# EAGLE design Drapled-PWM (EAGLE 5.11)
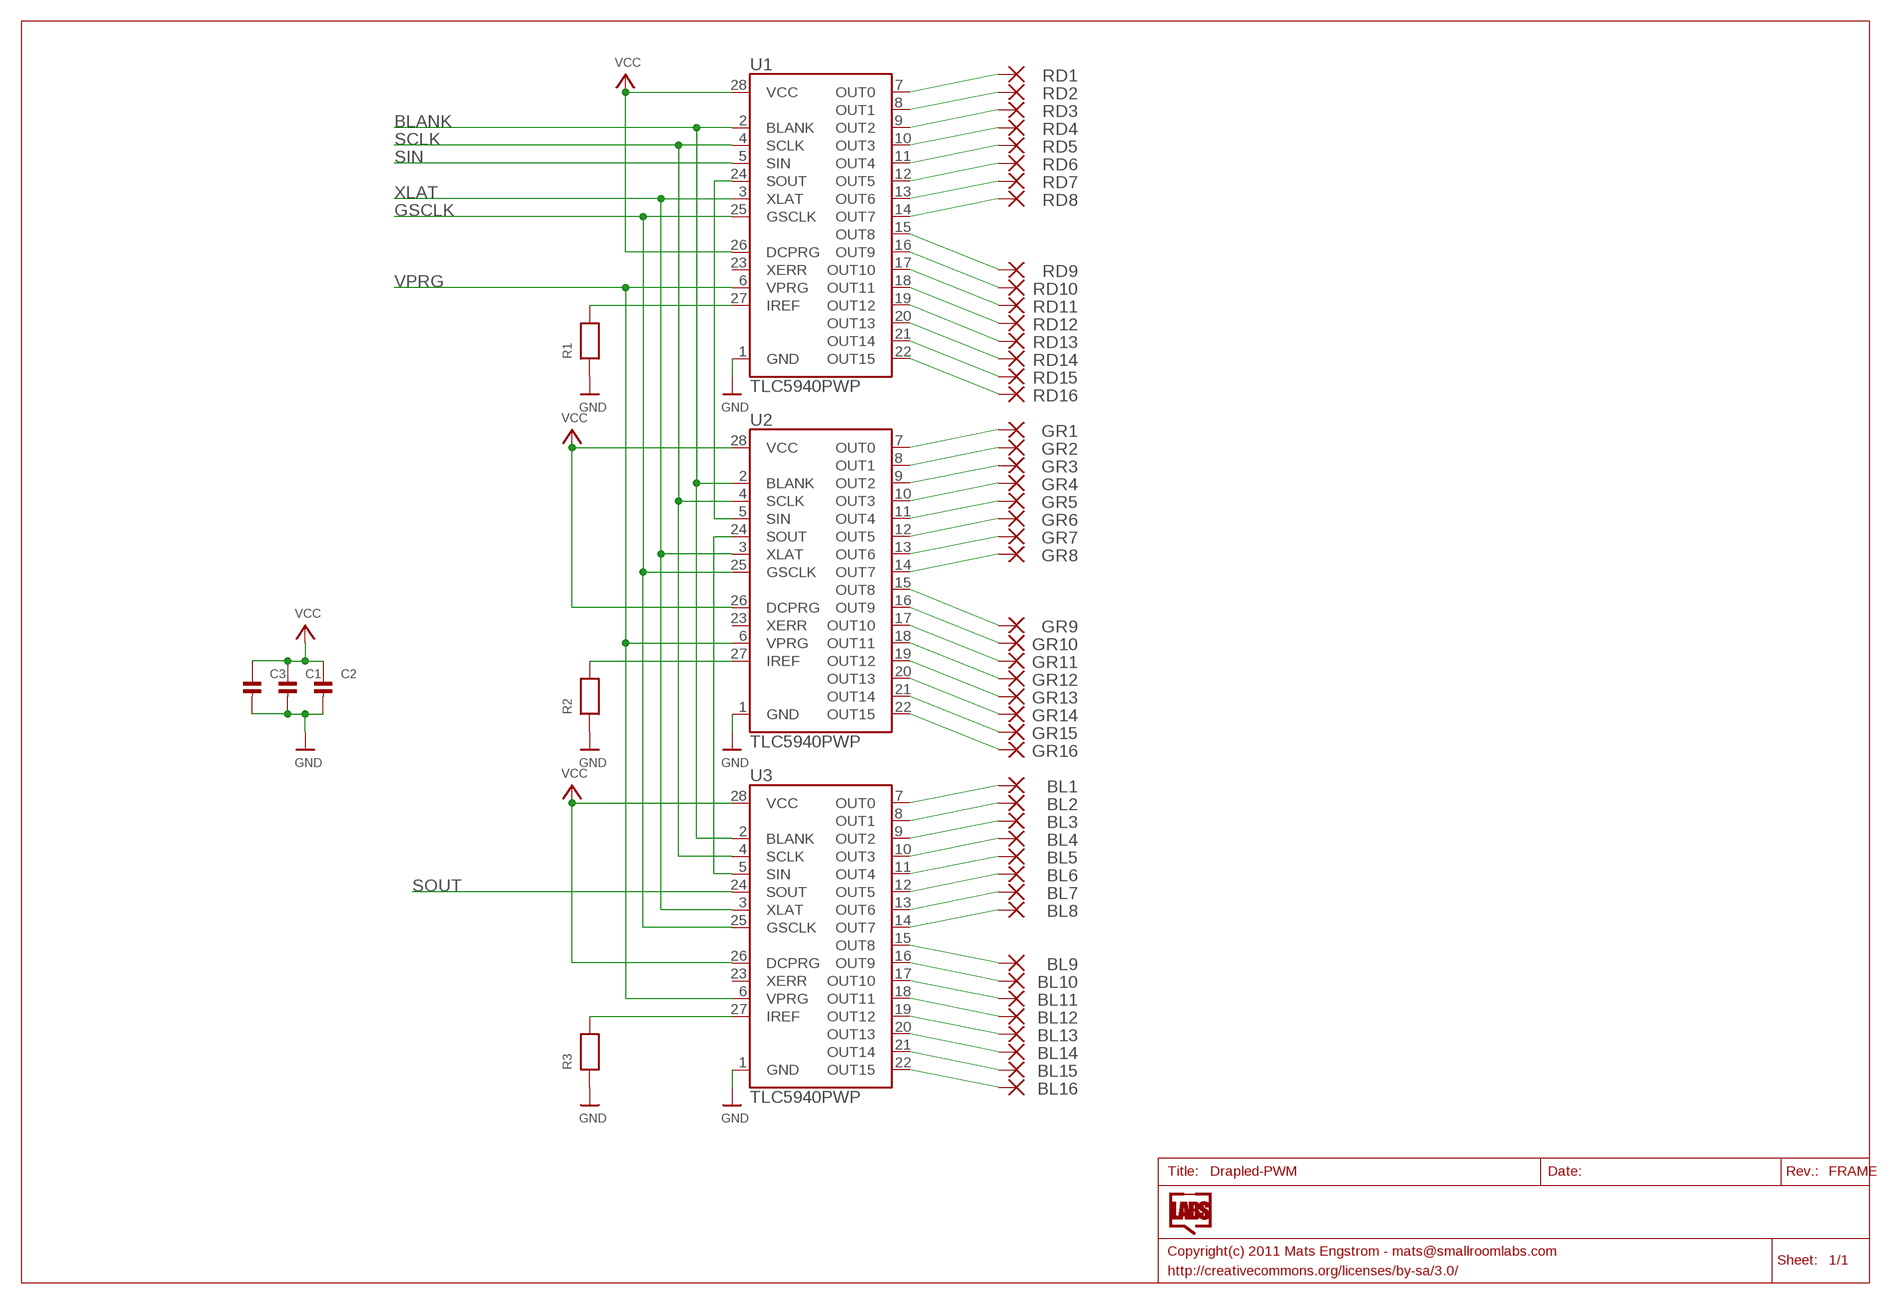
[diagram p0: schematic, sheet 1]

## Parts
BL1  1,6/0,9  [1,6/0,9]
BL2  1,6/0,9  [1,6/0,9]
BL3  1,6/0,9  [1,6/0,9]
BL4  1,6/0,9  [1,6/0,9]
BL5  1,6/0,9  [1,6/0,9]
BL6  1,6/0,9  [1,6/0,9]
BL7  1,6/0,9  [1,6/0,9]
BL8  1,6/0,9  [1,6/0,9]
BL9  1,6/0,9  [1,6/0,9]
BL10  1,6/0,9  [1,6/0,9]
BL11  1,6/0,9  [1,6/0,9]
BL12  1,6/0,9  [1,6/0,9]
BL13  1,6/0,9  [1,6/0,9]
BL14  1,6/0,9  [1,6/0,9]
BL15  1,6/0,9  [1,6/0,9]
BL16  1,6/0,9  [1,6/0,9]
C1  CAP_CERAMIC0805  [0805]
C2  CAP_CERAMIC0805  [0805]
C3  CAP_CERAMIC0805  [0805]
GR1  1,6/0,9  [1,6/0,9]
GR2  1,6/0,9  [1,6/0,9]
GR3  1,6/0,9  [1,6/0,9]
GR4  1,6/0,9  [1,6/0,9]
GR5  1,6/0,9  [1,6/0,9]
GR6  1,6/0,9  [1,6/0,9]
GR7  1,6/0,9  [1,6/0,9]
GR8  1,6/0,9  [1,6/0,9]
GR9  1,6/0,9  [1,6/0,9]
GR10  1,6/0,9  [1,6/0,9]
GR11  1,6/0,9  [1,6/0,9]
GR12  1,6/0,9  [1,6/0,9]
GR13  1,6/0,9  [1,6/0,9]
GR14  1,6/0,9  [1,6/0,9]
GR15  1,6/0,9  [1,6/0,9]
GR16  1,6/0,9  [1,6/0,9]
R1  RESISTOR0805  [0805]
R2  RESISTOR0805  [0805]
R3  RESISTOR0805  [0805]
RD1  1,6/0,9  [1,6/0,9]
RD2  1,6/0,9  [1,6/0,9]
RD3  1,6/0,9  [1,6/0,9]
RD4  1,6/0,9  [1,6/0,9]
RD5  1,6/0,9  [1,6/0,9]
RD6  1,6/0,9  [1,6/0,9]
RD7  1,6/0,9  [1,6/0,9]
RD8  1,6/0,9  [1,6/0,9]
RD9  1,6/0,9  [1,6/0,9]
RD10  1,6/0,9  [1,6/0,9]
RD11  1,6/0,9  [1,6/0,9]
RD12  1,6/0,9  [1,6/0,9]
RD13  1,6/0,9  [1,6/0,9]
RD14  1,6/0,9  [1,6/0,9]
RD15  1,6/0,9  [1,6/0,9]
RD16  1,6/0,9  [1,6/0,9]
U1  TLC5940PWP  [TSSOP28-GROUNDPAD]
U2  TLC5940PWP  [TSSOP28-GROUNDPAD]
U3  TLC5940PWP  [TSSOP28-GROUNDPAD]

## Nets
BLANK: U1.2(BLANK) U2.2(BLANK) U3.2(BLANK)
GND [gnd]: C1.2 C2.2 C3.2 R1.1 R2.1 R3.1 U1.1(GND) U2.1(GND) U3.1(GND)
GSCLK: U1.25(GSCLK) U2.25(GSCLK) U3.25(GSCLK)
LED1B: BL1.1(P) U3.7(OUT0)
LED1G: GR1.1(P) U2.7(OUT0)
LED1R: RD1.1(P) U1.7(OUT0)
LED2B: BL2.1(P) U3.8(OUT1)
LED2G: GR2.1(P) U2.8(OUT1)
LED2R: RD2.1(P) U1.8(OUT1)
LED3B: BL3.1(P) U3.9(OUT2)
LED3G: GR3.1(P) U2.9(OUT2)
LED3R: RD3.1(P) U1.9(OUT2)
LED4B: BL4.1(P) U3.10(OUT3)
LED4G: GR4.1(P) U2.10(OUT3)
LED4R: RD4.1(P) U1.10(OUT3)
LED5B: BL5.1(P) U3.11(OUT4)
LED5G: GR5.1(P) U2.11(OUT4)
LED5R: RD5.1(P) U1.11(OUT4)
LED6B: BL6.1(P) U3.12(OUT5)
LED6G: GR6.1(P) U2.12(OUT5)
LED6R: RD6.1(P) U1.12(OUT5)
LED7B: BL7.1(P) U3.13(OUT6)
LED7G: GR7.1(P) U2.13(OUT6)
LED7R: RD7.1(P) U1.13(OUT6)
LED8B: BL8.1(P) U3.14(OUT7)
LED8G: GR8.1(P) U2.14(OUT7)
LED8R: RD8.1(P) U1.14(OUT7)
LED9B: BL9.1(P) U3.15(OUT8)
LED9G: GR9.1(P) U2.15(OUT8)
LED9R: RD9.1(P) U1.15(OUT8)
LED10B: BL10.1(P) U3.16(OUT9)
LED10G: GR10.1(P) U2.16(OUT9)
LED10R: RD10.1(P) U1.16(OUT9)
LED11B: BL11.1(P) U3.17(OUT10)
LED11G: GR11.1(P) U2.17(OUT10)
LED11R: RD11.1(P) U1.17(OUT10)
LED12B: BL12.1(P) U3.18(OUT11)
LED12G: GR12.1(P) U2.18(OUT11)
LED12R: RD12.1(P) U1.18(OUT11)
LED13B: BL13.1(P) U3.19(OUT12)
LED13G: GR13.1(P) U2.19(OUT12)
LED13R: RD13.1(P) U1.19(OUT12)
LED14B: BL14.1(P) U3.20(OUT13)
LED14G: GR14.1(P) U2.20(OUT13)
LED14R: RD14.1(P) U1.20(OUT13)
LED15B: BL15.1(P) U3.21(OUT14)
LED15G: GR15.1(P) U2.21(OUT14)
LED15R: RD15.1(P) U1.21(OUT14)
LED16B: BL16.1(P) U3.22(OUT15)
LED16G: GR16.1(P) U2.22(OUT15)
LED16R: RD16.1(P) U1.22(OUT15)
N$34: U1.24(SOUT) U2.5(SIN)
N$39: R1.2 U1.27(IREF)
N$40: R2.2 U2.27(IREF)
N$59: R3.2 U3.27(IREF)
N$61: U2.24(SOUT) U3.5(SIN)
SCLK: U1.4(SCLK) U2.4(SCLK) U3.4(SCLK)
SIN: U1.5(SIN)
SOUT: U3.24(SOUT)
VCC: C1.1 C2.1 C3.1 U1.26(DCPRG) U1.28(VCC) U2.26(DCPRG) U2.28(VCC) U3.26(DCPRG) U3.28(VCC)
VPRG: U1.6(VPRG) U2.6(VPRG) U3.6(VPRG)
XLAT: U1.3(XLAT) U2.3(XLAT) U3.3(XLAT)
Unconnected: U1.23(XERR) U2.23(XERR) U3.23(XERR)

## Library data of the parts
BL1-BL16 GR1-GR16 RD1-RD16 = wirepad:1,6/0,9: THROUGH-HOLE PAD
C1-C3 = microbuilder:CAP_CERAMIC: Ceramic Capacitors 0402 - 0402 Surface Mount Capacitors 0.1uF 10V 10% [Digikey: 490-1318-2-ND] 0603 - 0603 Surface Mount Capacitors 16 pF 50V 5% [Digikey: 445-5051-2-ND] 22 pF 50V [Digikey: PCC220ACVTR-ND] 33 pF 50V 5% [Digikey: 490-1415-1-ND] 56pF 50V 5% [Digikey: 490-1421-1-ND] 220pF 50V 5% [Digikey: 445-1285-1-ND] 680 pF 50V 2200 pF 50V 5% C0G [Digikey: 445-1297-1-ND] 5600 pF 100V 5% X7R [Digikey: 478-3711-1-ND] 0.1 µF 25V 10% [Digikey: PCC2277TR-ND] 0.22 µF 16V 10% X7R [Digikey: 445-1318-1-ND] 1.0 µF 25V 10% [Digikey: 445-5146-2-ND] 0603 - RF Specific 3pF 250V +/-0.1pF RF [Digikey: 712-1347-1-ND] 18 pF 250V 5% [Digikey: 478-3505-1-ND or 712-1322-1-ND] 56 pF 250V 5% C0G RF [Digikey: 490-4867-1-ND] 68 pF 250V RF [Digikey: 490-4868-1-ND] 0805 - 0805 Surface Mount Capacitors 220 pF 250V 2% RF Ceramic Capacitor [Digikey: 712-1398-1-ND] 1000 pF 50V 2% NP0 Ceramic Capacitor [Digikey: 478-3760-1-ND] 0.1 µF 25V 10% Ceramic Capacitor [Digikey: PCC1828TR-ND] 1.0 µF 16V 10% Ceramic Capacitor[Digikey: 490-1691-2-ND] 10.0 µF 10V 10% Ceramic Capacitor[Digikey: 709-1228-1-ND] 1206 - 1206 Surface Mount Capacitors
R1-R3 = microbuilder:RESISTOR: Resistors 0402 - 0402 Surface Mount Package 10.0K 1% 1/16W [Digikey: 311-10.0KLRTR-ND] 0603 - 0603 Surface Mount Package 0 Ohm 1/10 Watt 1% Resistor 15 Ohm 1/10 Watt 1% Resistor 33 Ohm 1/10 Watt 1% Resistor 49.9 Ohm 1/10 Watt 1% Resistor 100 Ohm 1/10 Watt 1% Resistor 150 Ohm 1/10 Watt 1% Resistor 240 Ohm 1/10 Watt 1% Resistor 390 Ohm 1/10 Watt 1% Resistor 560 Ohm 1/10 Watt 1% Resistor 750 Ohm 1/10 Watt 1% Resistor 1.0K Ohm 1/10 Watt 1% Resistor 1.5K Ohm 1/10 Watt 1% Resistor 2.0K Ohm 1/10 Watt 1% Resistor 4.7K Ohm 1/10 Watt 1% Resistor 10.0K Ohm 1/10 Watt 1% Resistor 20.0K Ohm 1/10 Watt 1% Resistor 33.0K Ohm 1/10 Watt 1% Resistor 100.0K Ohm 1/10 Watt 1% Resistor 0805 - 0805 Surface Mount Package 0 Ohm 1/8 Watt 1% Resistor 33 Ohm 1/8 Watt 1% Resistor 100 Ohm 1/8 Watt 1% Resistor 150 Ohm 1/8 Watt 1% Resistor 200 Ohm 1/8 Watt 1% Resistor 240 Ohm 1/8 Watt 1% Resistor 330 Ohm 1/8 Watt 1% Resistor 390 Ohm 1/8 Watt 1% Resistor 470 Ohm 1/8 Watt 1% Resistor 1.0K Ohm 1/8 Watt 1% Resistor 1.5K Ohm 1/8 Watt 1% Resistor 2.0K Ohm 1/8 Watt 1% Resistor 4.7K Ohm 1/8 Watt 1% Resistor 5.1K Ohm 1/8 Watt 1% Resistor 5.6K Ohm 1/8 Watt 1% Resistor 10.0K Ohm 1/8 Watt 1% Resistor 22.0K Ohm 1/8 Watt 1% Resistor 33.0K Ohm 1/8 Watt 1% Resistor 100K Ohm 1/8 Watt 1% Resistor 1206 - 1206 Surface Mount Package
U1-U3 = SparkFun:TLC5940: TI TLC5940 16-channel LED Driver with Dot Correction and Grayscale PWM Control The TLC5940 is a 16-channel, constant-current sink LED driver. Each channel has an individually adjustable 4096-step grayscale PWM brightness control and a 64-step, constant-current sink (dot correction). The dot correction adjusts the brightness variations between LED channels and other LED drivers. The dot correction data is stored in an integrated EEPROM. Both grayscale control and dot correction are accessible via a serial interface. A single external resistor sets the maximum current value of all 16 channels. Packages: 28-pin HTSSOP 32-pin 5x5mm QFN 28-pin DIP

## Net classes
0 default: width 0.152 mm, clearance 0.152 mm
1 gnd: width 0.254 mm, clearance 0.178 mm

## Board
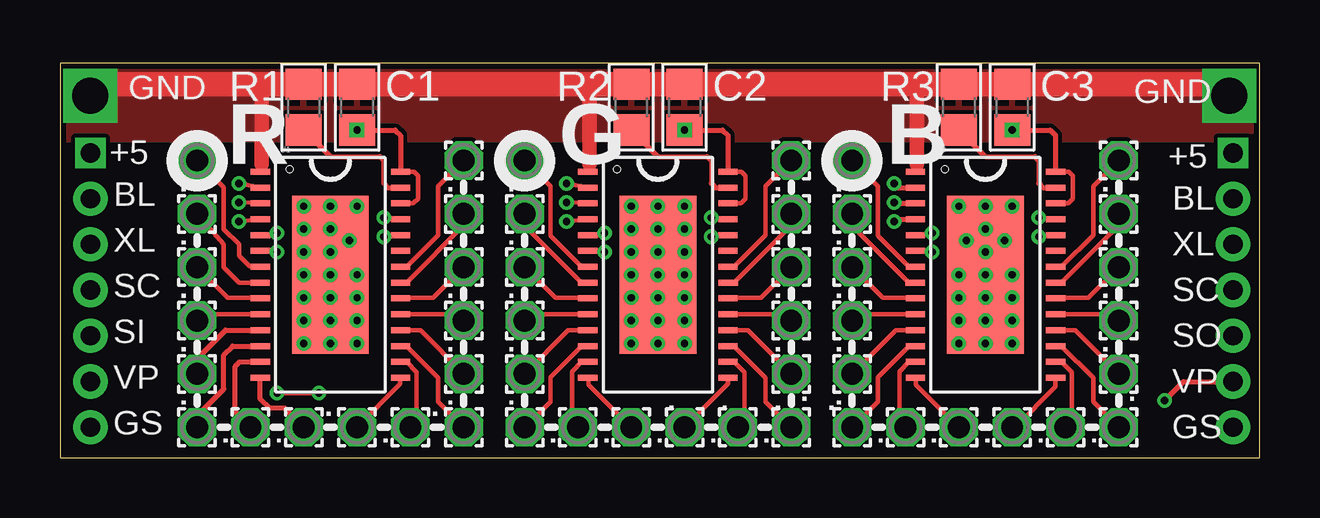
[diagram p1: board, top side]
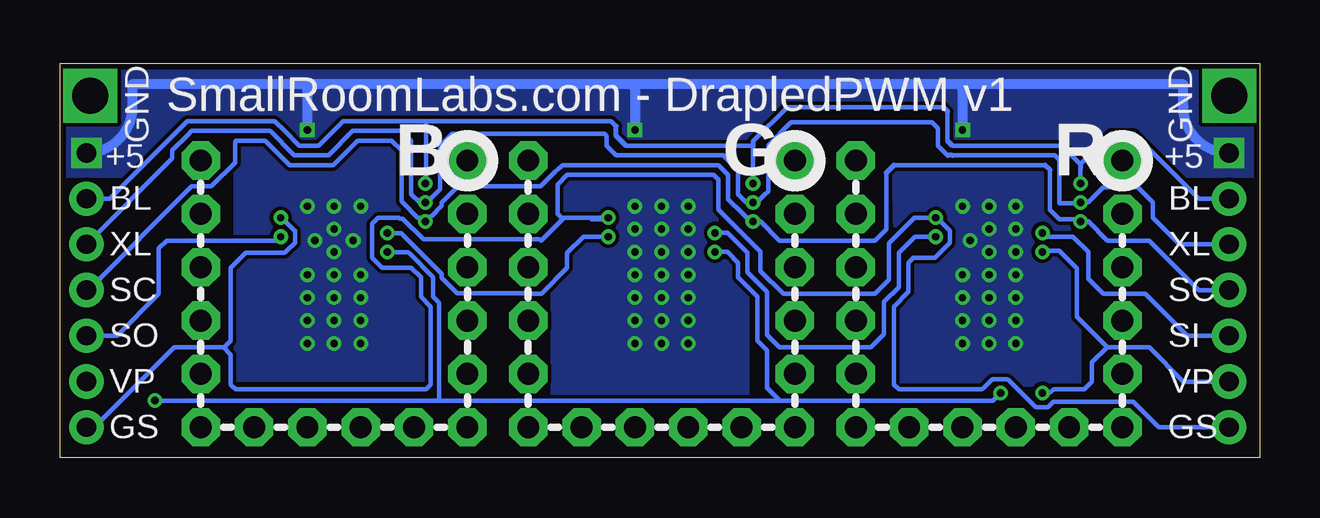
[diagram p2: board, bottom side, seen from below]

Size 50 x 16.43 mm. Coordinates in mm from the lower left corner, seen from the top.
Outline: 0,0 50,0 50,16.43 0,16.43 0,0
Copper layers (1*16): Top 0.035mm / dielectric 1.5mm / Bottom 0.035mm
Design rules "Fusion_eagle_rule_v1.1": minimum track width 6mil, minimum drill 12mil, track to track 6mil, track to pad 6mil, pad to pad 6mil, via to via 6mil, smd to smd 0mil, copper to edge 10mil, drill to drill 10mil, minimum pad ring 10mil, minimum via ring 6mil, stop-mask expansion 2mil, vias tented up to drill 100mil, thermal gap 10mil
tRestrict: area 7.3,2.9 to 11.7,12.4; area 22.9,2.9 to 27.3,12.4; area 38.4,2.9 to 42.9,12.4

### Footprints (pad centres in the part's own frame; a part is rotated, then mirrored left to right if it is on the bottom)
1,6/0,9 = drill 0.914 pad 1.6 octagon: 1 0,0
0805 = smd 1.3 x 1.5: 1 -0.95,0; 2 0.95,0
TSSOP28-GROUNDPAD = smd 0.8 x 0.25: 1 -2.921,4.298; 2 -2.921,3.637; 3 -2.921,2.977; 4 -2.921,2.317; 5 -2.921,1.656; 6 -2.921,0.996; 7 -2.921,0.335; 8 -2.927,-0.325; 9 -2.921,-0.985; 10 -2.921,-1.646; 11 -2.921,-2.306; 12 -2.921,-2.967; 13 -2.921,-3.627; 14 -2.921,-4.287; 15 2.921,-4.287; 16 2.921,-3.627; 17 2.921,-2.967; 18 2.921,-2.306; 19 2.921,-1.646; 20 2.921,-0.985; 21 2.927,-0.325; 22 2.921,0.335; 23 2.921,0.996; 24 2.921,1.656; 25 2.921,2.317; 26 2.921,2.977; 27 2.921,3.637; 28 2.921,4.298 | smd 3.2 x 6.6: 29 0,0.005

### Placement (x,y rotation side)
BL1  33.02,12.38 0 top
BL2  33.02,10.16 270 top
BL3  33.02,7.94 270 top
BL4  33.02,5.71 270 top
BL5  33.02,3.49 270 top
BL6  33.02,1.27 270 top
BL7  35.24,1.27 270 top
BL8  37.47,1.27 270 top
BL9  39.69,1.27 270 top
BL10  41.91,1.27 270 top
BL11  44.13,1.27 270 top
BL12  44.13,3.49 0 top
BL13  44.13,5.71 0 top
BL14  44.13,7.94 0 top
BL15  44.13,10.16 0 top
BL16  44.13,12.38 0 top
C1  12.38,14.61 90 top
C2  26.04,14.61 90 top
C3  39.69,14.61 90 top
GR1  19.37,12.38 270 top
GR2  19.37,10.16 270 top
GR3  19.37,7.94 270 top
GR4  19.37,5.71 270 top
GR5  19.37,3.49 270 top
GR6  19.37,1.27 270 top
GR7  21.59,1.27 270 top
GR8  23.81,1.27 270 top
GR9  26.04,1.27 270 top
GR10  28.26,1.27 270 top
GR11  30.48,1.27 270 top
GR12  30.48,3.49 270 top
GR13  30.48,5.71 270 top
GR14  30.48,7.94 270 top
GR15  30.48,10.16 270 top
GR16  30.48,12.38 270 top
R1  10.16,14.61 270 top
R2  23.81,14.61 270 top
R3  37.47,14.61 270 top
RD1  5.71,12.38 270 top
RD2  5.71,10.16 270 top
RD3  5.71,7.94 270 top
RD4  5.71,5.71 270 top
RD5  5.71,3.49 270 top
RD6  5.71,1.27 270 top
RD7  7.94,1.27 270 top
RD8  10.16,1.27 270 top
RD9  12.38,1.27 270 top
RD10  14.61,1.27 270 top
RD11  16.83,1.27 270 top
RD12  16.83,3.49 270 top
RD13  16.83,5.71 270 top
RD14  16.83,7.94 270 top
RD15  16.83,10.16 270 top
RD16  16.83,12.38 270 top
U1  11.27,7.62 0 top
U2  24.92,7.62 0 top
U3  38.58,7.62 0 top

### Tracks (layer width: path | path; a pad name or v marks a point on that pad's centre or on a via)
BLANK  (via drill 0.3, 0.8 pad 1.42)
  Top 0.178: v7.46,11.43 U1.2 | v21.11,11.43 U2.2
  Top 0.203: U3.2 34.77,11.26 v34.77,11.43
  Bottom 0.178: 7.46,12.06 v7.46,11.43 | v1.27,10.79 2.54,10.79 4.45,12.7 5.24,13.49 6.19,13.49 7.46,12.22 8.24,13.01 12.8,13.01 | v21.11,11.43 21.11,13.01 26.42,13.01 | 21.11,13.18 19.68,14.61 14.92,14.61 13.65,14.61 13.18,14.61 | 13.01,13.21 13.01,14.43 | 26.82,13.82 27.03,14.02 34.75,14.02 | 34.75,14.02 38.2,14.02 38.41,13.82 39.22,13.01 40.03,13.01 40.64,13.61 41.05,14.02 44.7,14.02 47.93,10.79 v48.9,10.79 | v34.77,11.43 34.75,11.45 34.75,14.02
  Bottom 0.203: 7.46,12.22 7.46,12.06 | 21.11,13.18 21.11,13.01 | 12.8,13.01 13.01,13.21 | 13.01,14.43 13.18,14.61 | 26.82,13.82 26.82,13.41 26.42,13.01
COOLING1  (via drill 0.3)
  other vias: 10.16,10.48 10.16,9.53 10.16,8.57 10.16,7.62 10.16,6.67 10.16,5.71 10.16,4.76 12.38,10.48 12.38,7.62 12.38,6.67 12.38,5.71 12.38,4.76 11.27,10.48 11.27,9.53 11.27,8.57 11.27,7.62 11.27,6.67 11.27,5.71 11.27,4.76 12.06,9.05
  pour Bottom: 8.94,11.99 15.24,11.99 15.04,3.05 7.52,3.05 7.52,11.99
COOLING2  (via drill 0.3)
  other vias: 23.81,6.67 23.81,7.62 23.81,10.48 24.92,9.53 24.92,10.48 26.04,10.48 26.04,9.53 26.04,8.57 26.04,7.62 26.04,6.67 23.81,4.76 23.81,5.71 24.92,8.57 24.92,7.62 24.92,6.67 24.92,5.71 24.92,4.76 26.04,4.76 26.04,5.71 23.81,9.53 23.81,8.57
  pour Bottom: 21.74,11.79 29.46,11.79 29.46,2.64 21.34,2.64 21.34,11.79
COOLING3  (via drill 0.3)
  other vias: 37.47,10.48 37.78,9.05 37.47,7.62 37.47,6.67 37.47,5.71 37.47,4.76 39.69,10.48 39.37,9.05 39.69,7.62 39.69,6.67 39.69,5.71 39.69,4.76 38.58,4.76 38.58,5.71 38.58,6.67 38.58,7.62 38.58,8.57 38.58,9.53 38.58,10.48
  pour Bottom: 34.75,3.25 42.67,3.25 42.67,13 34.75,13
GND  (via drill 1.5)
  Top 0.254: U1.1 8.41,11.92 8.41,12.22 | U2.1 22.07,11.92 22.07,12.22 | U3.1 35.66,12.22 35.72,12.22
  Top 0.61: 8.41,15.55 8.41,12.22 | 22.07,12.22 22.07,15.4 22.23,15.55 | 35.72,12.22 35.72,15.55 35.88,15.55
  Top 1.016: v1.27,15.08 1.74,15.55 8.41,15.55 R1.1 C1.2 22.23,15.55 R2.1 C2.2 35.56,15.55 35.88,15.55 R3.1 C3.2 48.26,15.55 v48.74,15.08
  pour Top: 0,13.25 49.75,13.25 49.75,16.25 0,16.25 0,13.5
GSCLK  (via drill 0.3, 0.8 pad 1.42)
  Top 0.178: v13.49,10 13.43,9.94 U1.25 | v27.15,10 U2.25 | v40.8,10 U3.25
  Bottom 0.178: v13.49,10 | U2.25 27.21,9.94 v27.15,10 | v48.9,1.27 48.58,1.27 45.24,4.6 43.18,4.6 | v13.49,10 13.56,9.94 | v13.49,10 13.41,9.96 12.9,9.45 12.9,8.97 13.54,8.33 14.43,8.33 14.63,8.13 14.63,7.11 14.63,6.91 15.24,6.3 15.24,5.08 15.24,3.05 15.04,2.85 14.83,2.85 11.58,2.85 11.51,2.9 11.12,3.28 10.54,3.28 10.46,3.25 9.32,2.11 8.81,2.11 8.59,2.34 5.26,2.34 4.19,1.27 v1.27,1.27 | v13.49,10 14.38,10 15.44,8.94 15.44,7.42 16.03,6.83 19.84,6.83 20.8,7.78 20.8,8.57 22.55,10.33 22.55,10.97 22.55,11.58 22.76,11.79 28.85,11.79 29.26,11.38 29.26,10.16 29.1,10 v27.15,10 | v27.15,10 29,10 29.95,9.05 30.02,9.09 34.85,9.09 35.71,9.96 35.81,9.96 35.88,10 36.73,10 36.8,9.93 36.98,9.75 36.98,8.33 36.58,7.92 35.36,7.92 34.95,7.52 34.95,6.91 34.95,6.71 34.54,6.3 34.54,3.05 34.75,2.85 39.62,2.85 42.67,2.85 42.88,3.05 42.88,4.3 43.18,4.6 | 43.18,4.6 43.15,4.6 42.88,4.88 42.88,7.72 42.88,7.92 42.27,8.53 40.64,8.53 40.59,8.59 40.21,8.97 40.21,9.45 40.26,9.5 40.74,9.98 40.79,9.98 v40.8,10
LED1B
  Top 0.178: U3.7 35.65,7.98 35.37,7.98 34.1,9.25 34.1,11.3 33.03,12.37 BL1.1
LED1G
  Top 0.178: U2.7 22,7.98 21.72,7.98 20.45,9.25 20.45,11.3 GR1.1
LED1R
  Top 0.178: U1.7 8.34,7.98 8.06,7.98 7.9,7.98 7.46,8.41 7.46,8.89 6.83,9.53 6.83,11.27 RD1.1
LED2B
  Top 0.178: U3.8 35.65,7.32 35.37,7.32 33.03,9.65 33.03,10.16 BL2.1
LED2G
  Top 0.178: U2.8 22,7.32 21.72,7.32 19.38,9.65 GR2.1
LED2R
  Top 0.178: U1.8 7.47,7.29 6.83,7.94 6.83,8.73 6.83,8.89 RD2.1
LED3B
  Top 0.178: U3.9 35.65,6.66 34.3,6.66 33.03,7.92 BL3.1
LED3G
  Top 0.178: U2.9 22,6.66 20.65,6.66 19.38,7.92 GR3.1
LED3R
  Top 0.178: U1.9 8.34,6.66 7,6.66 5.73,7.92 RD3.1
LED4B
  Top 0.178: U3.10 33.29,5.97 33.03,5.71 BL4.1
LED4G
  Top 0.178: U2.10 19.63,5.97 GR4.1
LED4R
  Top 0.178: U1.10 5.98,5.97 5.73,5.71 RD4.1
LED5B
  Top 0.178: U3.11 34.84,5.31 33.03,3.5 BL5.1
LED5G
  Top 0.178: U2.11 21.18,5.31 19.38,3.5 GR5.1
LED5R
  Top 0.203: U1.11 6.9,5.31 5.71,4.13 RD5.1
LED6B
  Top 0.178: U3.12 35.4,4.65 34.1,3.35 34.1,2.34 33.03,1.27 BL6.1
LED6G
  Top 0.178: U2.12 21.74,4.65 20.45,3.35 20.45,2.34 GR6.1
LED6R
  Top 0.203: U1.12 7.19,4.65 6.83,4.29 6.83,2.86 5.71,1.75 RD6.1
LED7B
  Top 0.178: BL7.1 34.99,1.52 34.99,3.58 35.4,3.99 U3.13
LED7G
  Top 0.178: GR7.1 21.34,1.52 21.34,3.58 21.74,3.99 U2.13
LED7R
  Top 0.203: U1.13 7.49,3.99 7.3,3.81 7.3,1.91 RD7.1
LED8B
  Top 0.178: U3.14 35.67,3.33 35.67,3.05 37.45,1.27 BL8.1
LED8G
  Top 0.178: U2.14 22.02,3.33 22.02,3.05 GR8.1
LED8R
  Top 0.203: U1.14 8.35,2.44 8.73,2.06 9.37,2.06 RD8.1
LED9B
  Top 0.178: BL9.1 39.81,1.27 41.49,2.95 U3.15
LED9G
  Top 0.178: GR9.1 27.84,3.07 U2.15
LED9R
  Top 0.178: RD9.1 14.19,3.07 U1.15
LED10B
  Top 0.178: U3.16 41.52,3.99 41.74,3.99 42.18,3.56 42.18,1.52 41.92,1.27 BL10.1
LED10G
  Top 0.178: U2.16 27.86,3.99 28.09,3.99 28.52,3.56 28.52,1.52 GR10.1
LED10R
  Top 0.178: U1.16 14.21,3.99 14.44,3.99 14.87,3.56 14.87,1.52 RD10.1
LED11B
  Top 0.178: BL11.1 43.07,2.34 43.07,3.33 41.74,4.65 41.52,4.65 U3.17
LED11G
  Top 0.178: GR11.1 29.41,2.34 29.41,3.33 28.09,4.65 27.86,4.65 U2.17
LED11R
  Top 0.178: RD11.1 15.76,2.34 15.76,3.33 14.44,4.65 14.21,4.65 U1.17
LED12B
  Top 0.178: U3.18 41.52,5.31 42.33,5.31 44.13,3.5 BL12.1
LED12G
  Top 0.178: U2.18 27.86,5.31 28.68,5.31 30.48,3.5 GR12.1
LED12R
  Top 0.178: U1.18 14.21,5.31 15.02,5.31 16.83,3.5 RD12.1
LED13B
  Top 0.178: BL13.1 43.88,5.97 41.52,5.97 U3.19
LED13G
  Top 0.178: GR13.1 30.23,5.97 27.86,5.97 U2.19
LED13R
  Top 0.178: RD13.1 16.57,5.97 14.21,5.97 U1.19
LED14B
  Top 0.178: U3.20 41.52,6.66 42.86,6.66 44.13,7.92 BL14.1
LED14G
  Top 0.178: U2.20 27.86,6.66 29.21,6.66 30.48,7.92 GR14.1
LED14R
  Top 0.178: U1.20 14.21,6.66 15.56,6.66 16.83,7.92 RD14.1
LED15B
  Top 0.178: BL15.1 44.13,9.68 41.77,7.32 41.52,7.32 U3.21
LED15G
  Top 0.178: GR15.1 30.48,9.68 28.12,7.32 27.86,7.32 U2.21
LED15R
  Top 0.178: RD15.1 16.83,9.68 14.46,7.32 14.21,7.32 U1.21
LED16B
  Top 0.178: U3.22 41.52,7.98 41.77,7.98 43.07,9.27 43.07,11.3 BL16.1
LED16G
  Top 0.178: U2.22 27.86,7.98 28.12,7.98 29.41,9.27 29.41,11.3 GR16.1
LED16R
  Top 0.178: U1.22 14.21,7.98 14.46,7.98 15.76,9.27 15.76,11.3 RD16.1
N$34  (via drill 0.3)
  Top 0.178: U2.5 22.77,9.28 v22.7,9.37
  Top 0.203: v13.49,9.21 13.56,9.28 U1.24
  Bottom 0.178: v13.49,9.21 14.36,9.21 15.04,8.53 15.04,7.32 15.04,7.11 15.65,6.5 15.65,5.15 16.19,4.6 20,4.6 20.52,5.12 20.52,6.91 21.34,7.72 21.34,8.53 22.17,9.37 v22.7,9.37
N$39
  Top 0.203: U1.27 13.67,11.26 13.49,11.43 13.49,12.38 13.34,12.54 11.27,12.54 R1.2
N$40
  Top 0.203: U2.27 27.32,11.26 27.15,11.43 27.15,12.38 26.99,12.54 24.93,12.54 R2.2
N$59
  Top 0.203: U3.27 40.97,11.26 40.8,11.43 40.8,12.38 40.64,12.54 38.58,12.54 R3.2
N$61  (via drill 0.3)
  Top 0.178: U2.24 27.06,9.28 v27.15,9.21 | v36.35,9.37 U3.5
  Bottom 0.178: v27.15,9.21 28.18,9.21 28.85,8.53 28.85,7.91 29.93,6.83 30.3,6.83 30.38,6.86 33.45,6.86 34.09,7.49 34.09,7.67 35.71,9.3 35.76,9.35 36.35,9.35 v36.35,9.37
SCLK  (via drill 0.3, 0.8 pad 1.42)
  Top 0.178: v7.46,9.84 U1.4 | v21.11,9.84 U2.4
  Top 0.203: v34.77,9.84 34.86,9.94 U3.4
  Bottom 0.178: v1.27,6.99 2.54,6.99 4.6,9.05 6.35,9.05 7.14,9.84 v7.46,9.84 7.55,9.94 U1.4 8.74,10.32 8.74,11.99 | v21.11,9.84 20.8,9.84 20,9.05 16.03,9.05 15.56,9.53 15.56,11.87 | v34.77,9.84 34.77,9.86 34.87,9.96 34.92,10 35.08,10 35.72,10.64 35.76,10.68 35.76,12.8 36.17,13.21 37.59,13.21 38.61,12.19 40.44,12.19 41.45,13.21 42.67,13.21 42.7,13.13 42.7,12.29 43.69,11.3 44.5,11.3 48.82,6.99 v48.9,6.99 | v34.77,9.84 34.7,9.88 | 8.94,12.19 15.24,12.19 | v21.11,9.84 21.21,9.94 | v21.11,9.84 21.22,9.84 21.54,10.16 22.15,10.77 22.15,11.79 22.55,12.19 27.03,12.19 29.06,12.19 29.26,11.99 29.34,11.94 29.97,11.3 33.4,11.3 34.09,10.62 34.09,10.49 34.52,10.06 34.54,10.06 34.65,9.96 v34.77,9.84
  Bottom 0.203: 8.74,11.99 8.94,12.19 | 15.24,12.19 15.56,11.87
SIN  (via drill 0.3, 0.8 pad 1.42)
  Top 0.178: U1.5 9.14,9.28 v9.05,9.37
  Bottom 0.178: v1.27,5.08 3.02,5.08 4.6,6.67 | 4.6,6.67 | 4.6,6.67 4.76,6.83 6.51,6.83 7.14,7.46 7.14,8.57 7.78,9.21 8.89,9.21 v9.05,9.37
SOUT  (via drill 0.3, 0.8 pad 1.42)
  Top 0.178: U3.24 v40.8,9.21
  Bottom 0.178: v48.9,5.08 47.62,5.08 45.88,6.83 45.88,8.73 45.56,9.05 40.96,9.05 v40.8,9.21
VCC  (via drill 0.3, 0.8 pad 1.27)
  Top 0.178: U1.26 14.72,10.6 14.92,10.79 14.92,11.75 14.75,11.92 U1.28 | U2.26 28.38,10.6 28.57,10.79 28.57,11.75 28.41,11.92 U2.28 | U3.26 42.03,10.6 42.23,10.79 42.23,11.75 42.06,11.92 U3.28 | v39.69,13.65 | v26.04,13.65 | v12.38,13.65 12.06,13.65 v12.38,13.65
  Top 0.203: U1.28 14.19,13.43 13.97,13.65 v12.38,13.65 | U2.28 27.84,13.43 27.62,13.65 v26.04,13.65 | U3.28 41.5,13.43 41.27,13.65 v39.69,13.65
  Bottom 0.178: 12.39,13.66 v12.38,13.65 | 12.39,15.56 12.39,15.37 | 26.04,15.56 26.04,15.37 | C2.1 v26.04,13.65 | C3.1 v39.69,13.65 | 39.7,15.56 39.7,15.37
  Bottom 0.406: 12.39,15.37 12.39,13.66 | 26.04,15.37 C2.1 | 39.7,15.37 C3.1 | v1.27,12.7 arc90 3.17,14.61 3.17,15.56 12.39,15.56 26.04,15.56 39.7,15.56 46.99,15.56 46.99,14.61 arc90 v48.9,12.7
  pour Bottom: 0,11.75 49.75,11.75 49.75,16.25 0,16.25
VPRG  (via drill 0.3, 0.8 pad 1.42)
  Top 0.178: U1.6 9.16,8.62 v9.05,8.57 | v22.7,8.57 22.05,8.57 U2.6 | v36.35,8.57 U3.6
  Top 0.203: v46.04,2.38 46.83,3.17 v48.9,3.17 | v9.05,2.7 v10.79,2.7
  Bottom 0.178: v1.27,3.17 3.17,3.17 4.6,4.6 6.35,4.6 | 6.35,4.6 6.51,4.76 | 6.51,4.76 6.77,5.02 7.62,5.87 7.62,7.89 U1.6 9.01,8.62 v9.05,8.57 | v46.04,2.38 37.15,2.38 34.19,2.38 | 19.91,2.38 14.76,2.38 14.45,2.38 11.11,2.38 v10.79,2.7 | 19.91,2.38 19.98,2.38 20.52,2.92 20.52,4.47 20.93,4.88 20.93,6.71 21.74,7.52 21.74,8.13 22.19,8.57 v22.7,8.57 | 6.51,4.76 | v9.05,2.7 9.07,2.72 8.71,2.72 8.57,2.86 7.3,2.86 6.99,3.17 6.99,3.97 6.35,4.6 | 34.19,2.38 34.14,2.38 33.93,2.38 28.89,2.38 19.91,2.38 | v36.35,8.57 v36.35,8.56 35.48,8.56 35.43,8.51 34.44,7.52 34.44,7.44 34.44,6.71 34.19,6.45 34.19,2.46 34.19,2.38
XLAT  (via drill 0.3, 0.8 pad 1.42)
  Top 0.178: v7.46,10.64 U1.3 | v21.11,10.64 U2.3
  Top 0.203: U3.3 34.77,10.6 v34.77,10.64
  Bottom 0.178: v1.27,8.89 3.33,8.89 4.45,10 4.45,10.64 5.08,11.27 6.51,11.27 7.14,10.64 v7.46,10.64 7.5,10.6 U1.3 8.35,12.41 8.53,12.6 12.8,12.6 | v1.27,8.89 | v34.77,10.64 34.92,10.64 | v34.77,10.64 34.67,10.67 34.16,11.18 34.16,12.93 34.13,13.02 33.66,13.49 29.69,13.49 27.31,13.49 27.23,13.41 27.23,13.01 26.82,12.6 22.35,12.6 | 13.01,12.6 13.41,13.01 13.41,13.73 13.65,13.97 15.24,13.97 19.53,13.97 20.48,13.02 20.48,11.11 20.64,10.95 20.95,10.64 v21.11,10.64 21.41,10.64 21.74,10.97 21.74,11.99 | v48.9,8.89 45.31,12.47 45.31,12.8 44.7,13.41 44.5,13.61 41.25,13.61 40.23,12.6 38.81,12.6 37.8,13.61 35.76,13.61 35.36,13.21 35.36,10.97 35.02,10.64 v34.77,10.64
  Bottom 0.203: 12.8,12.6 13.01,12.6 | 21.74,11.99 22.35,12.6

### Text on the board
tPlace: GND | GND | +5 | R | G | B | +5 | BL | BL | XL | XL | SC | SC | SI | SO | VP | VP | GS | GS
bPlace: GND | GND | SmallRoomLabs.com - DrapledPWM v1 | +5 | R | G | B | +5 | BL | BL | XL | XL | SC | SC | SI | SO | VP | VP | GS | GS